# Altium schematic sheet MCU.SchDoc
size A4; SheetNumber: 6; SheetTotal: 6
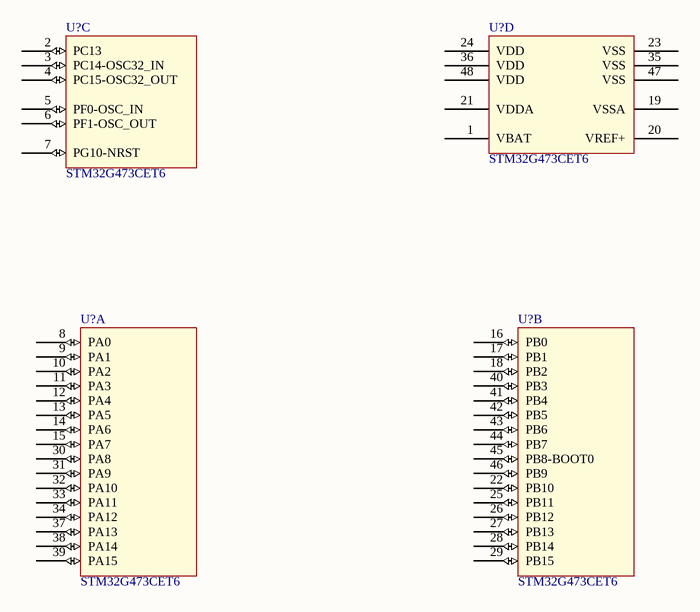
[diagram p0: MCU.SchDoc]

## Parts
(Parts that share a designator on the sheet are numbered #1, #2 ... from top to bottom, then left to right.)
U?#1  STM32G473CET6  [LQFP-48]  (part D of 4)
U?#2  STM32G473CET6  [LQFP-48]  (part C of 4)
U?#3  STM32G473CET6  [LQFP-48]  (part A of 4)
U?#4  STM32G473CET6  [LQFP-48]  (part B of 4)

## Nets

Not connected (* = marked no-connect by the designer): U?#1 1(VBAT) 19(VSSA) 20(VREF+) 21(VDDA) 23(VSS) 24(VDD) 35(VSS) 36(VDD) 47(VSS) 48(VDD); U?#2 2(PC13) 3(PC14-OSC32_IN) 4(PC15-OSC32_OUT) 5(PF0-OSC_IN) 6(PF1-OSC_OUT) 7(PG10-NRST); U?#3 8(PA0) 9(PA1) 10(PA2) 11(PA3) 12(PA4) 13(PA5) 14(PA6) 15(PA7) 30(PA8) 31(PA9) 32(PA10) 33(PA11) 34(PA12) 37(PA13) 38(PA14) 39(PA15); U?#4 16(PB0) 17(PB1) 18(PB2) 22(PB10) 25(PB11) 26(PB12) 27(PB13) 28(PB14) 29(PB15) 40(PB3) 41(PB4) 42(PB5) 43(PB6) 44(PB7) 45(PB8-BOOT0) 46(PB9)

## Library data of the parts
U?#1-U?#4 = STM32G473CET6: No Description Available; Mfr_Name: STMicroelectronics; RefDes: RefDes; Type: Type